# EAGLE design BackscatterPlantSensor_v6_3soic_coax_rmi_2layer (EAGLE 6.4)

## Sheet 1 of 4
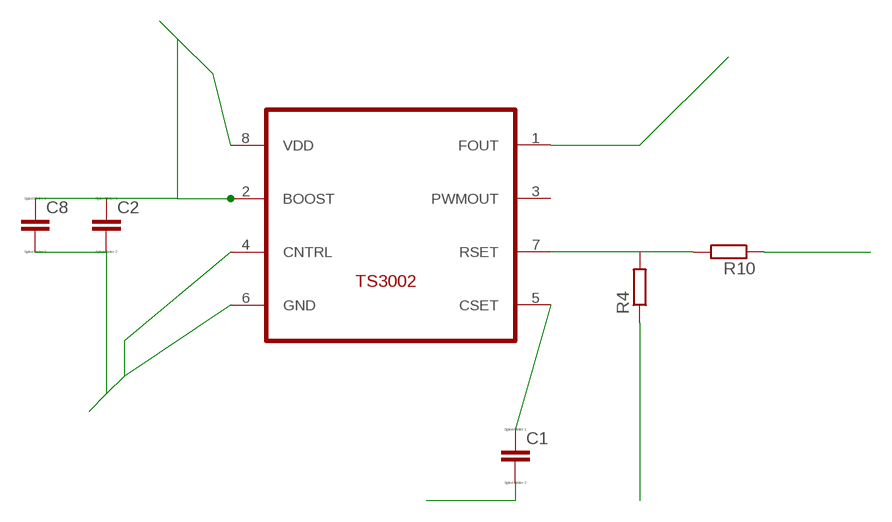
[diagram p0: schematic, sheet 1]

### Parts
C1  CC0603  [C0603]
C2  CC0603  [C0603]
C8  CC0603  [C0603]
R4  R-EU_R0603  [R0603]
R10  R-EU_R0603  [R0603]
U$1  TS3002  [TDFN22-8]

### Nets
AGND: R4.1 ; also sheet 4
DGND: C1.2 C2.2 C8.2 U$1.4(CNTRL) U$1.6(GND) ; also sheet 2
FOUT: U$1.1(FOUT) ; also sheet 2
N$1: C1.1 U$1.5(CSET)
N$2: R4.2 R10.2 U$1.7(RSET)
VCOND: R10.1 ; also sheet 4
VDD: C2.1 C8.1 U$1.2(BOOST) U$1.8(VDD) ; also sheet 3,4
Unconnected: U$1.3(PWMOUT)

## Sheet 2 of 4
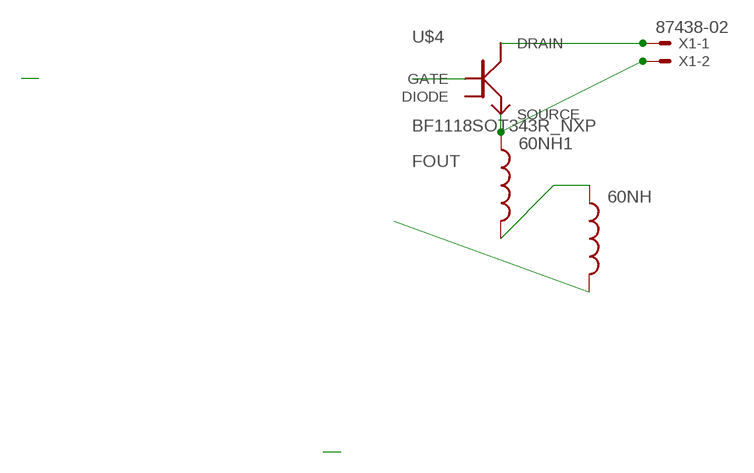
[diagram p1: schematic, sheet 2]

### Parts
60NH  INDUCTOR0402  [C0402]
60NH1  INDUCTOR0402  [C0402]
U$4  BF1118SOT343R_NXP  [SOT343R]
X1  87438-02  [87438-02]

### Nets
DGND: U$4.1(GATE) ; also sheet 1
FOUT: 60NH.2 ; also sheet 1
N$3: 60NH1.2 60NH.1
RF_MINUS: 60NH1.1 U$4.3(SOURCE) X1.2
RF_PLUS: U$4.4(DRAIN) X1.1
Unconnected: U$4.2(DIODE)

## Sheet 3 of 4
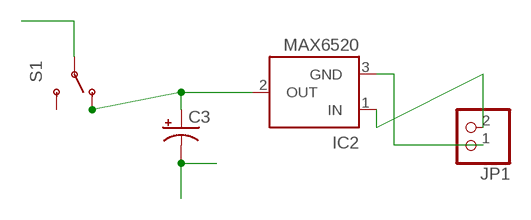
[diagram p2: schematic, sheet 3]

### Parts
C3  CAP_POL1206  [EIA3216]
IC2  MAX6520  [SOT23]
JP1  PINHD-1X2  [1X02]
S1  SWITCH-SPDTPTH  [SWITCH-SPDT]

### Nets
GND: C3.C(-) IC2.3(GND) JP1.1
N$4: IC2.1(IN) JP1.2
N$7: C3.A(+) IC2.2(OUT) S1.1(O)
VDD: S1.2(P) ; also sheet 1,4
Unconnected: S1.3(S)

## Sheet 4 of 4
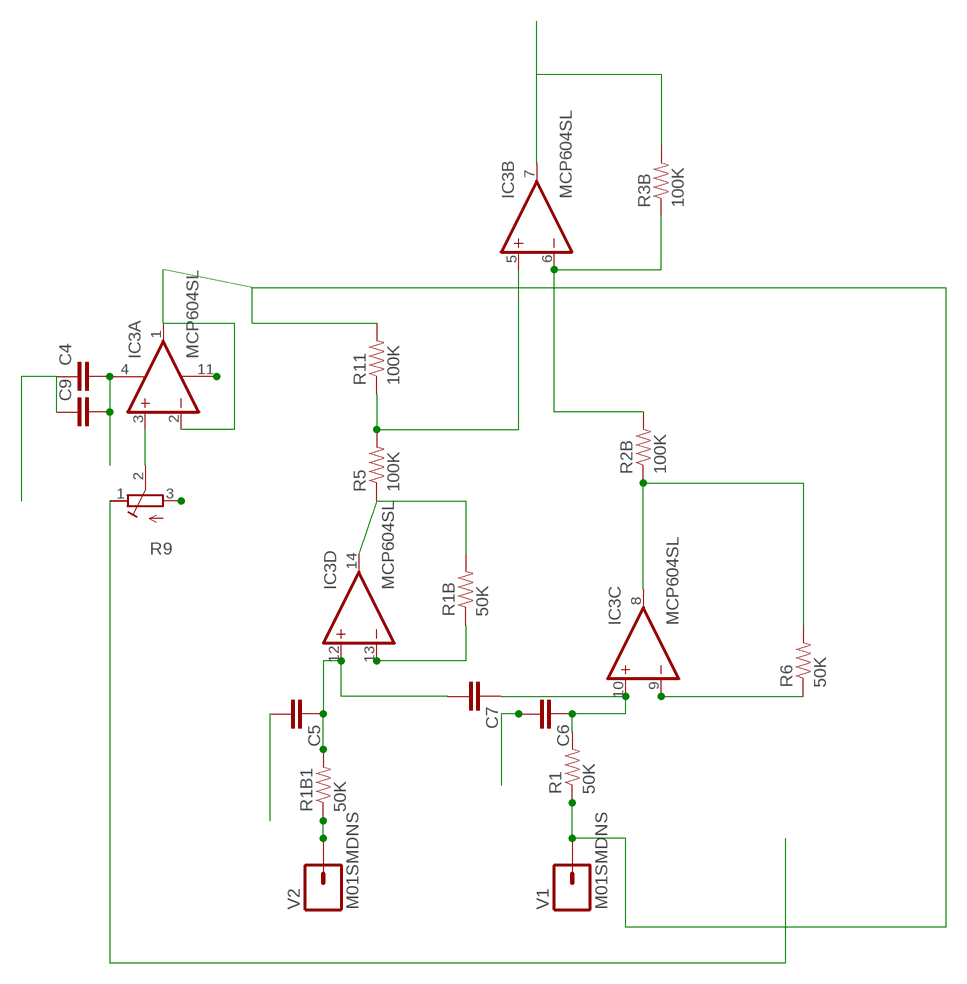
[diagram p3: schematic, sheet 4]

### Parts
C4  CAP0603-CAP  [0603-CAP]
C5  CAP0603-CAP  [0603-CAP]
C6  CAP0603-CAP  [0603-CAP]
C7  CAP0603-CAP  [0603-CAP]
C9  CAP0603-CAP  [0603-CAP]
IC3  MCP604SL  [SO14]
R1  50K  RESISTOR  [0805]
R1B  50K  RESISTOR  [0805]
R1B1  50K  RESISTOR  [0805]
R2B  100K  RESISTOR  [0805]
R3B  100K  RESISTOR  [0805]
R5  100K  RESISTOR  [0805]
R6  50K  RESISTOR  [0805]
R9  R-TRIMM3314G  [RTRIM3314G]
R11  100K  RESISTOR  [0805]
V1  M01SMDNS  [1X01NS]
V2  M01SMDNS  [1X01NS]

### Nets
AGND: C4.1 C5.2 C6.2 C9.1 IC3.11(P:V-) R9.3(A) ; also sheet 1
N$10: IC3.9(C:-IN) R6.1
N$12: C5.1 C7.2 IC3.12(D:+IN) R1B1.2
N$13: R1B1.1 V2.1
N$23: IC3.8(C:OUT) R2B.1 R6.2
N$49: IC3.14(D:OUT) R1B.2 R5.1
N$58: IC3.6(B:-IN) R2B.2 R3B.1
N$84: C6.1 C7.1 IC3.10(C:+IN) R1.2
N$105: IC3.3(A:+IN) R9.2(S)
N$107: IC3.13(D:-IN) R1B.1
N$118: IC3.5(B:+IN) R5.2 R11.1
VCOND: IC3.7(B:OUT) R3B.2 ; also sheet 1
VDD: C4.2 C9.2 IC3.4(P:V+) R9.1(E) ; also sheet 1,3
VRF1: IC3.1(A:OUT) IC3.2(A:-IN) R1.1 R11.2 V1.1

## Library data of the parts
60NH 60NH1 = SparkFun:INDUCTOR: Inductors Basic Inductor/Choke - 0603 and 1206. Footprints are not proven and vary greatly between part numbers.
C1 C2 C8 = eagle-ltspice:C: CAPACITOR, European symbol; SPICEMODEL: NONE; SPICEPREFIX: C
C3 = SparkFun-Capacitors:CAP_POL: Capacitor Polarized These are standard SMD and PTH capacitors. Normally 10uF, 47uF, and 100uF in electrolytic and tantalum varieties. Always verify the external diameter of the through hole cap, it varies with capacity, voltage, and manufacturer. The EIA devices should be standard.
C4-C7 C9 = SparkFun-Passives:CAP: Capacitor Standard 0603 ceramic capacitor, and 0.1" leaded capacitor.
IC2 = maxim:MAX6520: 1.2V Voltage Reference 50ppm/°C, SOT23, 3-Terminal Source: Data sheet <http://datasheets.maxim-ic.com/en/ds/MAX6520.pdf>; MF: MAXIM; MPN: MAX6520EUR-T; OC_FARNELL: unknown; OC_NEWARK: 02J4586
IC3 = linear:MCP604: Quad Op Amp 2.7V to 6.0V Single Supply CMOS Source: http://ww1.microchip.com/downloads/en/DeviceDoc/21314g.pdf
JP1 = pinhead:PINHD-1X2: PIN HEADER
R1 R1B R1B1 R2B R3B R5 R6 R11 = SparkFun:RESISTOR: Resistor Basic schematic elements and footprints for 0603, 1206, and PTH 1/10th watt (small) resistors.
R4 R10 = rcl:R-EU_: RESISTOR, European symbol
R9 = rcl:R-TRIMM: Trimm resistor
S1 = semipassiveTag_library:SWITCH-SPDT: SPST Switch Simple slide switch. Spark Fun Electronics SKU : COM-00102
U$1 = ts3002TDFN22_8pin:TS3002
U$4 = rf_transistors:BF1118
V1 V2 = SparkFun-Connectors:M01: Header 1 Standard 1-pin 0.1" header. Use with straight break away headers (SKU : PRT-00116), right angle break away headers (PRT-00553), swiss pins (PRT-00743), machine pins (PRT-00117), and female headers (PRT-00115).
X1 = con-molex:87438-02: Wire-to-Board 1.50mm (.059") Pitch Header - Right Angle, SMT, Shrouded Source: http://www.molex.com/product/micro/87438.html; OC_FARNELL: 1711327; OC_NEWARK: unknown

## Board
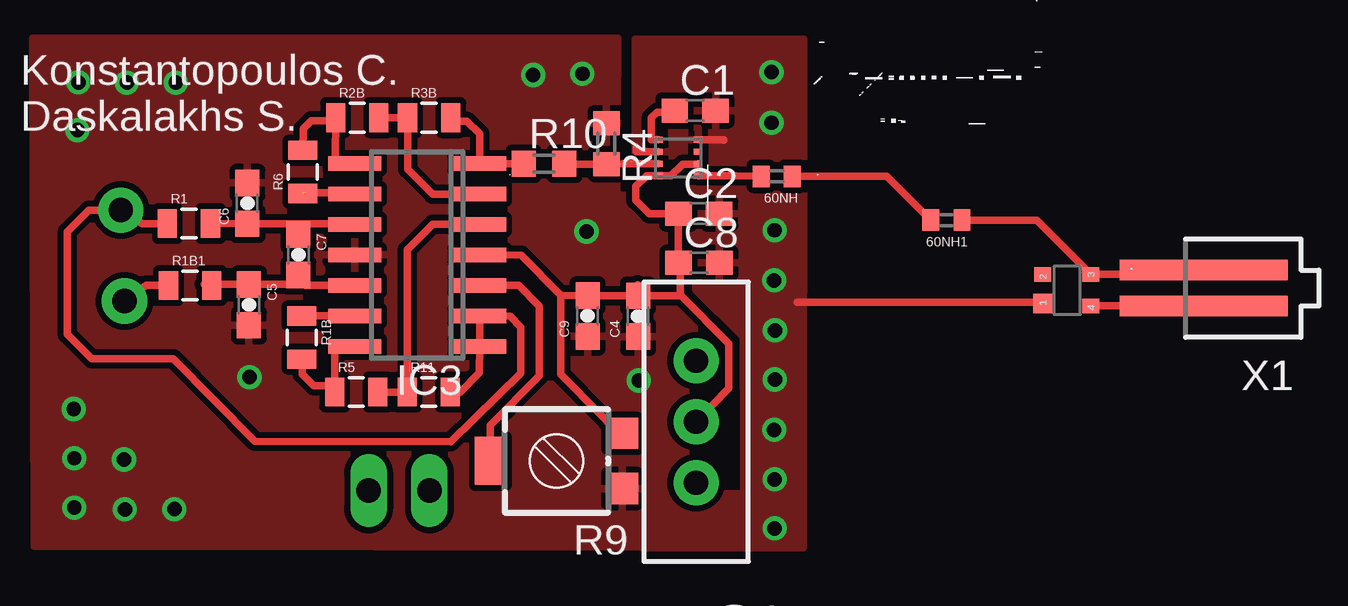
[diagram p4: board, top side]
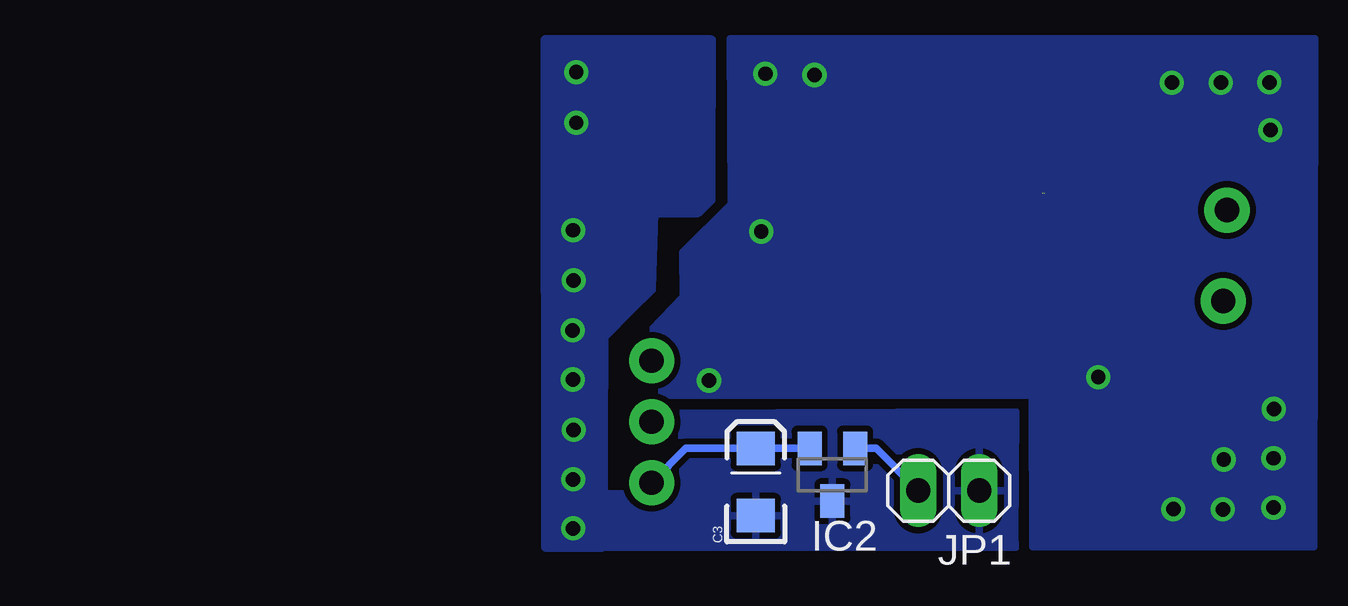
[diagram p5: board, bottom side, seen from below]

No outline drawn. Coordinates in mm, seen from the top.
Copper layers (1*16): Top 0.035mm / dielectric 1.5mm / Bottom 0.035mm
Design rules "default *": minimum track width 10mil, minimum drill 24mil, track to track 10mil, track to pad 10mil, pad to pad 10mil, via to via 10mil, smd to smd 10mil, copper to edge 40mil, drill to drill 8mil, minimum pad ring 10mil, minimum via ring 8mil, stop-mask expansion 4mil, vias tented up to drill 0mil, thermal gap 10mil

### Footprints (pad centres in the part's own frame; a part is rotated, then mirrored left to right if it is on the bottom)
C0402 = smd 0.7 x 0.9: 1 -0.65,0; 2 0.65,0
C0603 = smd 1.1 x 1: 1 -0.85,0; 2 0.85,0
EIA3216 = smd 1.4 x 1.6: A 1.4,0; C -1.4,0
0603-CAP = smd 1.1 x 1: 1 -0.85,0; 2 0.85,0
SOT23 = smd 1 x 1.4: 1 -0.95,-1.1; 2 0.95,-1.1; 3 0,1.1
SO14 = smd 0.6 x 2.2: 1 -3.81,-2.6; 2 -2.54,-2.6; 3 -1.27,-2.6; 4 0,-2.6; 5 1.27,-2.6; 6 2.54,-2.6; 7 3.81,-2.6; 8 3.81,2.6; 9 2.54,2.6; 10 1.27,2.6; 11 0,2.6; 12 -1.27,2.6; 13 -2.54,2.6; 14 -3.81,2.6
1X02 = drill 1.016 long: 1 -1.27,0; 2 1.27,0
0805 = smd 0.8 x 1.2: 1 -0.9,0; 2 0.9,0
R0603 = smd 1 x 1.1: 1 -0.85,0; 2 0.85,0
RTRIM3314G = smd 1.3 x 1.3: 1 1.15,-2.75; 3 -1.15,-2.75 | smd 2 x 1.3: 2 0,2.75
SWITCH-SPDT = drill 1.016 pad 1.88: 1 0,2.54; 2 0,0; 3 0,-2.54
TDFN22-8 = smd 0.35 x 0.25: 1 -1.78,-0.7; 2 -1.78,-1.2; 3 -1.78,-1.7; 4 -1.78,-2.2; 5 -0.13,-2.2; 6 -0.13,-1.7; 7 -0.13,-1.2; 8 -0.13,-0.7
SOT343R = smd 0.8 x 0.8: 1 0.55,-1.07 | smd 0.6 x 0.7: 2 -0.66,-1.07; 3 -0.66,0.94; 4 0.65,0.94
1X01NS = drill 1.016 pad 1.88: 1 0,0
87438-02 = smd 7 x 0.85: 1 0,0.75; 2 0,-0.75

### Placement (x,y rotation side)
60NH  77.52,63.75 180 top
60NH1  84.59,61.92 180 top
C1  74.12,66.49 0 top
C2  74.27,62.19 0 top
C3  69.82,51.01 90 bottom
C4  71.74,57.92 90 top
C5  55.53,58.39 270 top
C6  55.46,62.62 90 top
C7  57.59,60.48 270 top
C8  74.28,60.14 0 top
C9  69.64,57.93 90 top
IC2  66.63,51.31 180 bottom
IC3  62.54,60.47 90 top
JP1  61.78,50.65 180 bottom
R1  53.03,61.78 0 top
R1B  57.73,57.03 270 top
R1B1  53.08,59.2 0 top
R2B  60.04,66.19 0 top
R3B  63.04,66.19 0 top
R4  70.42,65.11 270 top
R5  60,54.76 0 top
R6  57.78,63.93 90 top
R9  68.34,51.89 90 top
R10  67.82,64.27 0 top
R11  63.02,54.76 0 top
S1  74.16,53.52 180 top
U$1  72.46,63.06 180 top
U$4  89.67,59 270 top
V1  50.18,62.34 0 top
V2  50.34,58.55 0 top
X1  95.31,59.09 180 top

### Tracks (layer width: path | path; a pad name or v marks a point on that pad's centre or on a via)
AGND  (via drill 0.6)
  other vias: 71.77,55.24 55.55,55.38 48.23,54.05 48.25,52 48.25,49.94 50.32,51.95 50.36,49.87 52.42,49.88 48.38,65.67 48.42,67.66 50.44,67.65 52.48,67.65 67.37,67.97 69.42,68.02 69.59,61.45
  pour Top: 46.53,69.49 46.58,48.34 74.89,48.29 74.84,56.64 72.85,58.72 72.84,62.96 70.86,62.98 70.89,69.5
  pour Bottom: 70.88,69.48 46.52,69.47 46.57,48.32 58.28,48.32 58.3,54.63 74.9,54.62 74.85,56.62 74.57,56.91 72.84,58.73 72.86,60.58 70.85,62.59
DGND  (via drill 0.6)
  Top 0.254: U$1.4 74.76,65.26 74.78,65.28
  Top 0.305: C2.2 74.72,61.84 | U$1.6 71.67,64.76 71.67,64.95 | U$1.4 75.32,65.26 75.32,65.25 | U$4.1 88.56,58.49 78.38,58.49
  other vias: 77.3,65.98 77.3,68.09 77.43,61.5 77.41,59.41 77.45,57.33 77.44,55.28 77.41,53.18 77.43,51.12 77.43,49.08
  pour Bottom: 71.67,69.41 78.59,69.42 78.57,48.31 76.2,48.32 76.15,57.07 75.01,58.22 74.17,59.05 74.08,62.24 72.22,62.25 71.7,62.77 71.69,63.74
  pour Top: 71.63,69.45 78.64,69.46 78.62,48.26 76.17,48.27 76.12,57.07 74.14,59.01 73.96,63.76 71.63,63.7
FOUT
  Top 0.305: U$1.1 75.82,63.76 60NH.2
GND
  pour Bottom: 59.02,48.6 58.98,53.93 73.98,53.88 73.91,48.27 59.38,48.3 58.99,48.3
N$1
  Top 0.305: U$1.5 72.33,65.26 72.29,65.26 72.29,66.19 72.55,66.41 73.19,66.41 C1.1
N$2
  Top 0.305: R10.2 69.04,64.25 R4.2 71.11,64.26 U$1.7
N$3
  Top 0.305: 78.49,63.76 60NH.1 82.11,63.75 60NH1.2
N$4
  Bottom 0.305: JP1.2 64.81,52.41 IC2.1
N$7
  Bottom 0.305: S1.1 72.73,52.41 C3.A IC2.2
N$10  (1 unrouted)
  Top 0.305: IC3.9 59.89,63.06 57.88,63.06
N$12
  Top 0.305: IC3.12 57.88,59.2 C7.2 57.18,59.24 C5.1 53.67,59.24 R1B1.2
N$13
  Top 0.305: V2.1 51.25,59.2 R1B1.1
N$14
  pour Bottom: 76.36,48.28 72.16,48.3 72.08,50.53 76.38,50.54
N$15
  pour Top: 71.99,50.54 72.06,48.28 76.89,48.27 76.79,50.51
N$23
  Top 0.254: R2B.1 59.1,66.2
  Top 0.305: R6.2 57.79,65.73 58.13,66.06 58.92,66.06 R2B.1 59.13,64.51 59.34,64.3 59.92,64.3 IC3.8
N$49
  Top 0.305: R1B.2 57.75,55.5 58.22,55.03 58.82,55.03 R5.1 59.11,56.74 59.86,56.74 IC3.14
N$58
  Top 0.305: IC3.6 63.19,63 62.15,64.04 R3B.1 62.17,66.18 R2B.2
N$84
  Top 0.305: IC3.10 60.45,61.77 57.57,61.77 | 57.57,61.77 C6.1 55.44,61.79 R1.2 | 57.57,61.77 57.52,61.33 C7.1
N$105
  Top 0.305: R9.2 65.58,53.38 67.63,55.44 67.63,58.34 66.78,59.2 IC3.3
N$107
  Top 0.305: IC3.13 R1B.1
N$118
  Top 0.305: R11.1 62.13,60.69 63.18,61.74 IC3.5 | R5.2 R11.1 | 62.17,54.76 R11.1
RF_MINUS
  Top 0.305: X1.2 92.15,59.66 U$4.3 88.35,61.92 60NH1.1
RF_PLUS
  Top 0.305: U$4.4 92.31,58.35 X1.1
VCOND
  Top 0.305: R10.1 67.13,64.27 IC3.7 65.14,65.51 64.61,66.04 63.95,66.04 R3B.2
VDD
  Top 0.305: U$1.2 73.6,64.25 73.1,63.76 U$1.8 72.1,63.76 71.65,63.33 71.65,62.74 72.21,62.19 C2.1 73.42,60.15 C8.1 73.5,60.08 73.5,58.77 | C4.2 C9.2 68.57,58.8 68.51,58.8 | C4.2 71.72,59.22 | S1.2 75.53,54.91 75.53,56.77 73.54,58.76 73.5,58.77 | 73.5,58.77 C4.2 | 68.51,58.8 68.51,55.49 70.2,53.79 70.63,53.36 R9.1 | 68.51,58.8 66.87,60.46 IC3.4
VRF1
  Top 0.305: R11.2 64.33,54.76 65.13,55.56 IC3.1 IC3.2 66.41,57.92 66.86,57.46 66.85,55.54 63.93,52.69 55.77,52.71 52.38,56.14 48.97,56.14 47.96,57.16 47.96,61.44 48.85,62.34 V1.1 51.08,61.78 R1.1 51.78,61.75

### Text on the board
tPlace: Konstantopoulos C. / Daskalakhs S.